# EAGLE design AlephFDRv100a (EAGLE 6.5.0)
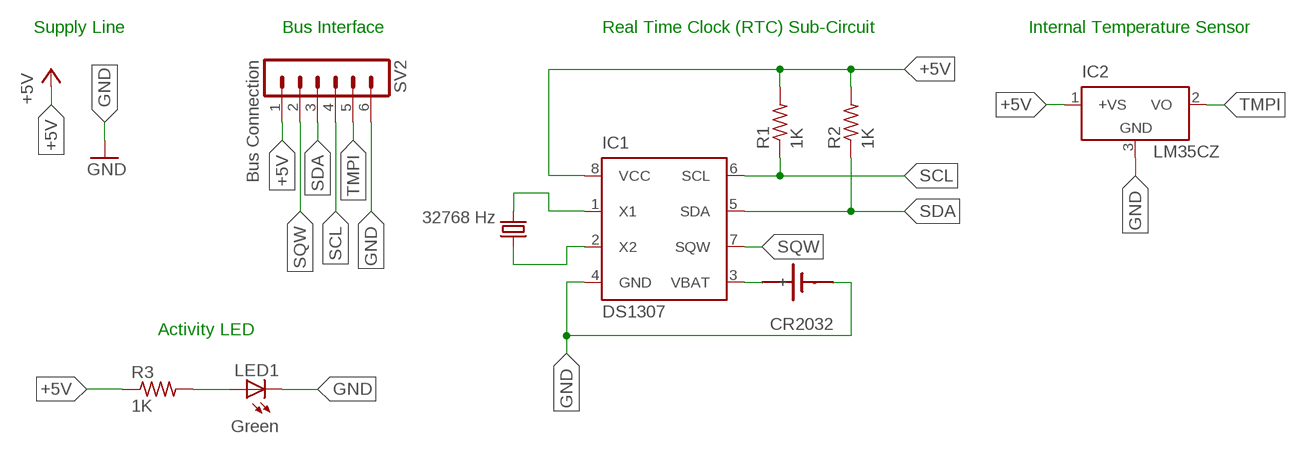
[diagram p0: schematic, sheet 1]

## Parts
BAT1  CR2032  SN2032  [SN2032]
IC1  DS1307  [DIL08]
IC2  LM35CZ  [TO92]
LED1  Green  LED3MM  [LED3MM]
Q1  32768 Hz  CRYSTALTC26H  [TC26H]
R1  1K  R-US_0207/10  [0207/10]
R2  1K  R-US_0207/10  [0207/10]
R3  1K  R-US_0207/10  [0207/10]
SV2  Bus Connection  MA06-1  [MA06-1]

## Nets
+5V: IC1.8(VCC) IC2.1(+VS) R1.2 R2.2 R3.1 SV2.1
GND: BAT1.- IC1.4(GND) IC2.3(GND) LED1.K(C) SV2.6
N$1: LED1.A R3.2
N$5: IC1.1(X1) Q1.2
N$6: IC1.2(X2) Q1.1
N$8: BAT1.+ IC1.3(VBAT)
SCL: IC1.6(SCL) R1.1 SV2.4
SDA: IC1.5(SDA) R2.1 SV2.3
SQW: IC1.7(SQW) SV2.2
TMPI: IC2.2(VO) SV2.5

## Notes on the sheet
- Supply Line | Bus Interface | Real Time Clock (RTC) Sub-Circuit | Internal Temperature Sensor
- Activity LED

## Library data of the parts
BAT1 = sn2032:SN2032: LI BATTERY
IC1 = ds1307_pcf8583:DS1307: I2C-Bus CLOCK/CALENDAR
IC2 = lm35:LM35: Single-Supply Centigrade Temperature Sensor Vout = (10mV/°C x Temp °C) +5mmmV Source: http://www.national.com/ds/LM/LM35.pdf
LED1 = led:LED: LED OSRAM: - CHIPLED LG R971, LG N971, LY N971, LG Q971, LY Q971, LO R971, LY R971 LH N974, LH R974 LS Q976, LO Q976, LY Q976 LO Q996 - Hyper CHIPLED LW Q18S LB Q993, LB Q99A, LB R99A - SideLED LS A670, LO A670, LY A670, LG A670, LP A670 LB A673, LV A673, LT A673, LW A673 LH A674 LY A675 LS A676, LA A676, LO A676, LY A676, LW A676 LS A679, LY A679, LG A679 - Hyper Micro SIDELED® LS Y876, LA Y876, LO Y876, LY Y876 LT Y87S - SmartLED LW L88C, LW L88S LB L89C, LB L89S, LG L890 LS L89K, LO L89K, LY L89K LS L896, LA L896, LO L896, LY L896 - TOPLED LS T670, LO T670, LY T670, LG T670, LP T670 LSG T670, LSP T670, LSY T670, LOP T670, LYG T670 LG T671, LOG T671, LSG T671 LB T673, LV T673, LT T673, LW T673 LH T674 LS T676, LA T676, LO T676, LY T676, LB T676, LH T676, LSB T676, LW T676 LB T67C, LV T67C, LT T67C, LS T67K, LO T67K, LY T67K, LW E67C LS E67B, LA E67B, LO E67B, LY E67B, LB E67C, LV E67C, LT E67C LW T67C LS T679, LY T679, LG T679 LS T770, LO T770, LY T770, LG T770, LP T770 LB T773, LV T773, LT T773, LW T773 LH T774 LS E675, LA E675, LY E675, LS T675 LS T776, LA T776, LO T776, LY T776, LB T776 LHGB T686 LT T68C, LB T68C - Hyper Mini TOPLED® LB M676 - Mini TOPLED Santana® LG M470 LS M47K, LO M47K, LY M47K Source: http://www.osram.convergy.de LUXEON: - LUMILED® LXK2-PW12-R00, LXK2-PW12-S00, LXK2-PW14-U00, LXK2-PW14-V00 LXK2-PM12-R00, LXK2-PM12-S00, LXK2-PM14-U00 LXK2-PE12-Q00, LXK2-PE12-R00, LXK2-PE12-S00, LXK2-PE14-T00, LXK2-PE14-U00 LXK2-PB12-K00, LXK2-PB12-L00, LXK2-PB12-M00, LXK2-PB14-N00, LXK2-PB14-P00, LXK2-PB14-Q00 LXK2-PR12-L00, LXK2-PR12-M00, LXK2-PR14-Q00, LXK2-PR14-R00 LXK2-PD12-Q00, LXK2-PD12-R00, LXK2-PD12-S00 LXK2-PH12-R00, LXK2-PH12-S00 LXK2-PL12-P00, LXK2-PL12-Q00, LXK2-PL12-R00 Source: www.luxeon.com KINGBRIGHT: KA-3528ASYC Source: www.kingbright.com
Q1 = crystal:CRYSTAL: CRYSTAL; OC_FARNELL: unknown; OC_NEWARK: unknown
R1-R3 = resistor:R-US_: RESISTOR, American symbol
SV2 = con-lstb:MA06-1: PIN HEADER; OC_FARNELL: unknown; OC_NEWARK: unknown

## Board
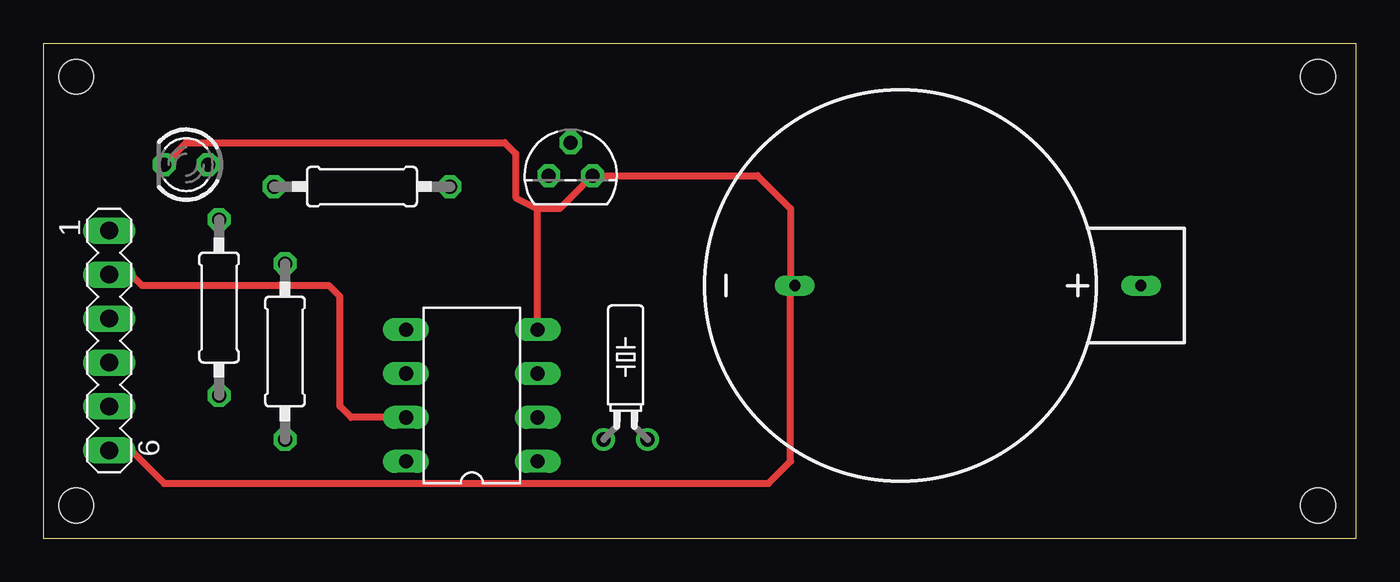
[diagram p1: board, top side]
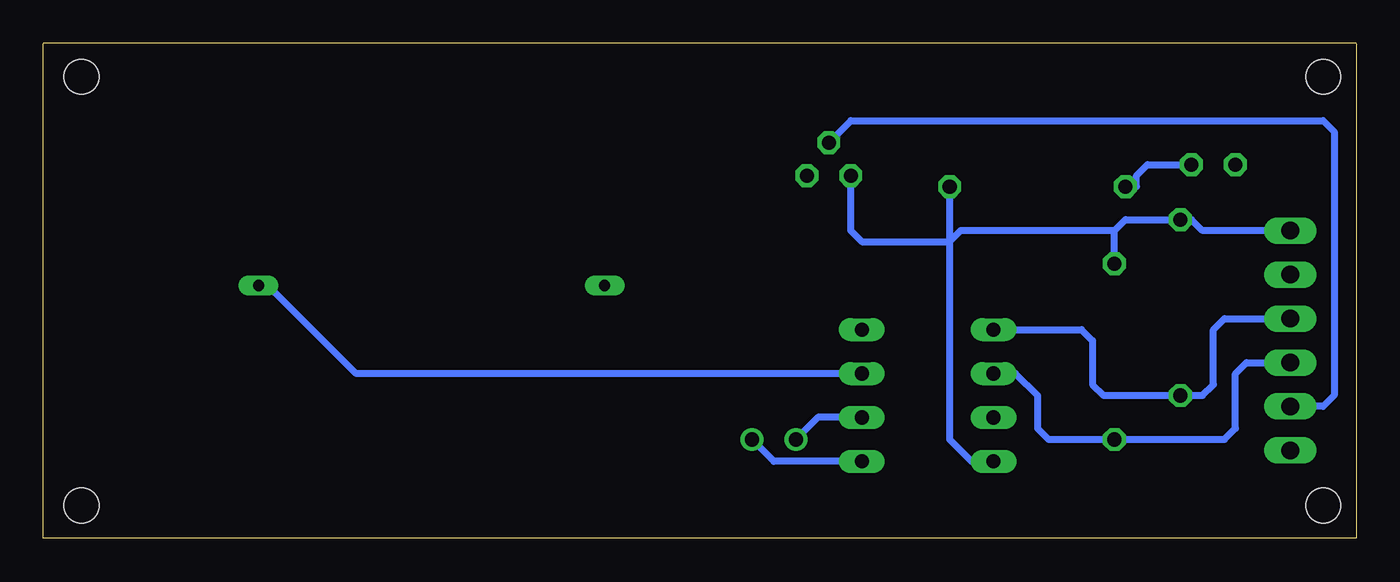
[diagram p2: board, bottom side, seen from below]

Size 75.87 x 28.6 mm. Coordinates in mm from the lower left corner, seen from the top.
Outline: 75.87,28.57 75.87,0 0,0 0,28.57
Outline: 0,28.6 75.87,28.6
Copper layers (1*16): Top 0.035mm / dielectric 1.5mm / Bottom 0.035mm
Design rules "SeeedStudio_2layer_DRU_no_angle_20140221": minimum track width 6mil, minimum drill 12mil, track to track 6mil, track to pad 6mil, pad to pad 6mil, via to via 6mil, smd to smd 0mil, copper to edge 10mil, drill to drill 10mil, minimum pad ring 10mil, minimum via ring 6mil, stop-mask expansion 2mil, vias tented up to drill 100mil, thermal gap 10mil
Holes 2 mm at 1.91,26.67 1.91,1.91 73.66,1.91 73.66,26.67

### Footprints (pad centres in the part's own frame; a part is rotated, then mirrored left to right if it is on the bottom)
SN2032 = drill 0.65 long: + 0,13.9; - 0,-6.1
DIL08 = drill 0.813 long: 1 -3.81,-3.81; 2 -1.27,-3.81; 3 1.27,-3.81; 4 3.81,-3.81; 5 3.81,3.81; 6 1.27,3.81; 7 -1.27,3.81; 8 -3.81,3.81
TO92 = drill 0.813 octagon: 1 -1.27,0; 2 0,1.905; 3 1.27,0
LED3MM = drill 0.813 octagon: A -1.27,0; K 1.27,0
TC26H = drill 0.813: 1 -1.27,0; 2 1.27,0
0207/10 = drill 0.813 octagon: 1 -5.08,0; 2 5.08,0
MA06-1 = drill 1.016 long: 1 -6.35,0; 2 -3.81,0; 3 -1.27,0; 4 1.27,0; 5 3.81,0; 6 6.35,0

### Placement (x,y rotation side)
BAT1  49.53,14.61 270 top
IC1  24.77,8.26 90 top
IC2  30.48,20.95 0 top
LED1  8.26,21.59 180 top
Q1  33.66,5.71 0 top
R1  13.97,10.79 90 top
R2  10.16,13.34 90 top
R3  18.41,20.32 180 top
SV2  3.81,11.43 270 top

### Tracks (layer width: path | path; a pad name or v marks a point on that pad's centre or on a via)
+5V
  Bottom 0.406: R1.2 13.97,17.78 | 13.97,17.78 13.34,18.41 R2.2 9.53,18.41 8.89,17.78 SV2.1 | R3.1 23.5,17.14 | 23.5,17.14 23.5,5.71 22.23,4.45 IC1.8 | 13.97,17.78 22.86,17.78 23.5,17.14 | 23.5,17.14 28.57,17.14 29.21,17.78 IC2.1
GND
  Top 0.406: SV2.6 5.08,5.08 6.99,3.17 41.91,3.17 43.18,4.45 43.18,14.36 BAT1.- 43.18,14.86 43.18,19.05 41.27,20.95 IC2.3 29.84,19.05 28.57,19.05 | IC1.4 28.57,19.05 | LED1.K 8.26,22.86 26.67,22.86 27.3,22.23 27.3,19.68 28.57,19.05
N$1
  Bottom 0.406: R3.2 12.7,20.32 12.7,20.95 12.06,21.59 LED1.A
N$5
  Bottom 0.406: IC1.1 33.66,4.45 Q1.2
N$6
  Bottom 0.406: IC1.2 31.11,6.99 Q1.1
N$8
  Bottom 0.406: IC1.3 57.78,9.53 62.87,14.61 BAT1.+
SCL
  Bottom 0.406: IC1.6 19.68,9.53 18.41,8.26 18.41,6.35 17.78,5.71 R1.1 7.62,5.71 6.99,6.35 6.99,9.53 6.35,10.16 SV2.4
SDA
  Bottom 0.406: IC1.5 15.88,12.06 15.24,11.43 15.24,8.89 14.61,8.26 R2.1 8.89,8.26 8.26,8.89 8.26,12.06 7.62,12.7 SV2.3
SQW
  Top 0.406: IC1.7 17.78,6.99 17.14,7.62 17.14,13.97 16.51,14.61 5.71,14.61 5.08,15.24 SV2.2
TMPI
  Bottom 0.406: SV2.5 1.91,7.62 1.27,8.26 1.27,23.5 1.91,24.13 29.21,24.13 IC2.2

### Text on the board
200bmp: /Volumes/TALENT/Aleph FDR 001a/hardware/board/Silkscreen-mask.bmp